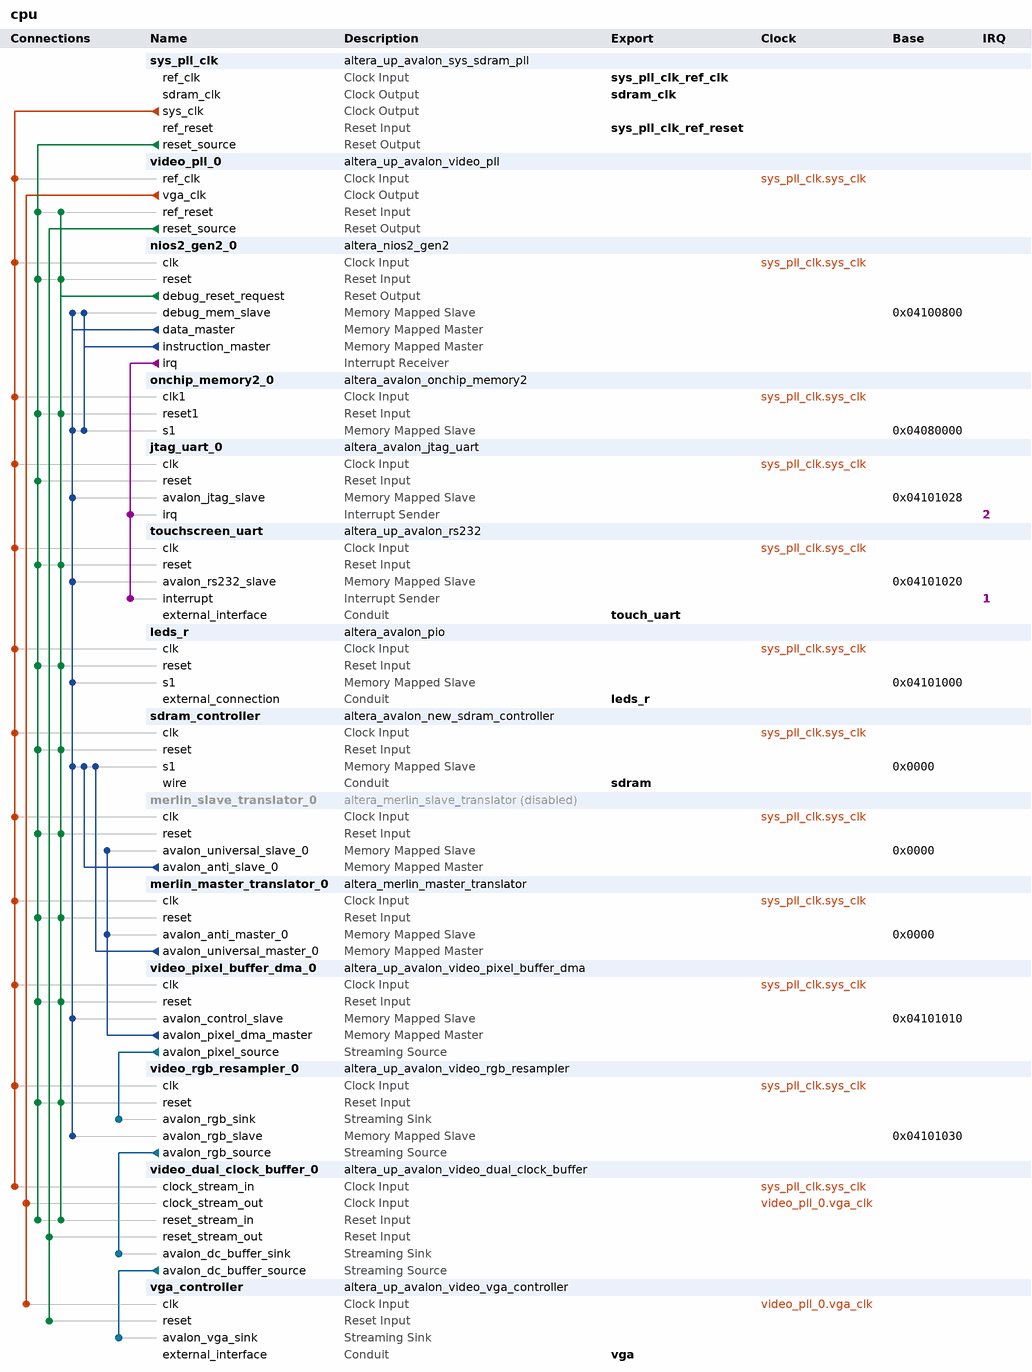
[diagram p0: system contents]
# Platform Designer (Qsys) system cpu, Cyclone V 5CSEMA5F31C6
# Parameters at their usual value, and those the tool derives, are not listed.
package require -exact qsys 18.1
create_system cpu
set_project_property DEVICE_FAMILY {Cyclone V}
set_project_property DEVICE 5CSEMA5F31C6

add_instance sys_pll_clk altera_up_avalon_sys_sdram_pll 18.0
set_instance_parameter_value sys_pll_clk CV_boards DE1-SoC
set_instance_parameter_value sys_pll_clk gui_outclk 50.0
set_instance_parameter_value sys_pll_clk gui_refclk 50.0

add_instance video_pll_0 altera_up_avalon_video_pll 18.0
set_instance_parameter_value video_pll_0 camera {8MP Digital Camera (D8M-GPIO)}
set_instance_parameter_value video_pll_0 gui_refclk 50.0
set_instance_parameter_value video_pll_0 lcd {7" LCD on VEEK-MT and MTL/MTL2 Modules}
set_instance_parameter_value video_pll_0 video_in_clk_en true

add_instance nios2_gen2_0 altera_nios2_gen2 18.1
set_instance_parameter_value nios2_gen2_0 dcache_size 2048
set_instance_parameter_value nios2_gen2_0 exceptionSlave onchip_memory2_0.s1
set_instance_parameter_value nios2_gen2_0 icache_size 4096
set_instance_parameter_value nios2_gen2_0 impl Tiny
set_instance_parameter_value nios2_gen2_0 resetSlave onchip_memory2_0.s1

add_instance onchip_memory2_0 altera_avalon_onchip_memory2 18.1
set_instance_parameter_value onchip_memory2_0 dataWidth 32
set_instance_parameter_value onchip_memory2_0 dualPort false
set_instance_parameter_value onchip_memory2_0 initMemContent true
set_instance_parameter_value onchip_memory2_0 initializationFileName onchip_mem.hex
set_instance_parameter_value onchip_memory2_0 memorySize 307200

add_instance jtag_uart_0 altera_avalon_jtag_uart 18.1
set_instance_parameter_value jtag_uart_0 simInteractiveOptions NO_INTERACTIVE_WINDOWS

add_instance touchscreen_uart altera_up_avalon_rs232 17.1
set_instance_parameter_value touchscreen_uart baud 9600
set_instance_parameter_value touchscreen_uart parity None

add_instance leds_r altera_avalon_pio 18.1
set_instance_parameter_value leds_r direction Output
set_instance_parameter_value leds_r width 8

add_instance sdram_controller altera_avalon_new_sdram_controller 18.1
set_instance_parameter_value sdram_controller TAC 5.4
set_instance_parameter_value sdram_controller TRCD 15.0
set_instance_parameter_value sdram_controller TRP 15.0
set_instance_parameter_value sdram_controller casLatency 3
set_instance_parameter_value sdram_controller columnWidth 10
set_instance_parameter_value sdram_controller dataWidth 16
set_instance_parameter_value sdram_controller generateSimulationModel false
set_instance_parameter_value sdram_controller model single_Micron_MT48LC4M32B2_7_chip
set_instance_parameter_value sdram_controller numberOfBanks 4
set_instance_parameter_value sdram_controller numberOfChipSelects 1
set_instance_parameter_value sdram_controller powerUpDelay 100.0
set_instance_parameter_value sdram_controller refreshPeriod 7.8125
set_instance_parameter_value sdram_controller rowWidth 13

add_instance merlin_slave_translator_0 altera_merlin_slave_translator 18.1
set_instance_property merlin_slave_translator_0 ENABLED false
set_instance_parameter_value merlin_slave_translator_0 AV_ADDRESSGROUP 0
set_instance_parameter_value merlin_slave_translator_0 AV_ADDRESS_SYMBOLS 0
set_instance_parameter_value merlin_slave_translator_0 AV_ADDRESS_W 25
set_instance_parameter_value merlin_slave_translator_0 AV_ALWAYSBURSTMAXBURST 0
set_instance_parameter_value merlin_slave_translator_0 AV_BITS_PER_SYMBOL 8
set_instance_parameter_value merlin_slave_translator_0 AV_BURSTBOUNDARIES 0
set_instance_parameter_value merlin_slave_translator_0 AV_BURSTCOUNT_SYMBOLS 0
set_instance_parameter_value merlin_slave_translator_0 AV_BURSTCOUNT_W 2
set_instance_parameter_value merlin_slave_translator_0 AV_BYTEENABLE_W 2
set_instance_parameter_value merlin_slave_translator_0 AV_CONSTANT_BURST_BEHAVIOR 0
set_instance_parameter_value merlin_slave_translator_0 AV_DATA_HOLD 0
set_instance_parameter_value merlin_slave_translator_0 AV_DATA_W 16
set_instance_parameter_value merlin_slave_translator_0 AV_INTERLEAVEBURSTS 0
set_instance_parameter_value merlin_slave_translator_0 AV_ISBIGENDIAN 0
set_instance_parameter_value merlin_slave_translator_0 AV_LINEWRAPBURSTS 0
set_instance_parameter_value merlin_slave_translator_0 AV_MAX_PENDING_READ_TRANSACTIONS 64
set_instance_parameter_value merlin_slave_translator_0 AV_MAX_PENDING_WRITE_TRANSACTIONS 0
set_instance_parameter_value merlin_slave_translator_0 AV_READLATENCY 0
set_instance_parameter_value merlin_slave_translator_0 AV_READ_WAIT 1
set_instance_parameter_value merlin_slave_translator_0 AV_REGISTERINCOMINGSIGNALS 0
set_instance_parameter_value merlin_slave_translator_0 AV_REGISTEROUTGOINGSIGNALS 0
set_instance_parameter_value merlin_slave_translator_0 AV_REQUIRE_UNALIGNED_ADDRESSES 0
set_instance_parameter_value merlin_slave_translator_0 AV_SETUP_WAIT 0
set_instance_parameter_value merlin_slave_translator_0 AV_SYMBOLS_PER_WORD 4
set_instance_parameter_value merlin_slave_translator_0 AV_TIMING_UNITS 1
set_instance_parameter_value merlin_slave_translator_0 AV_WRITE_WAIT 0
set_instance_parameter_value merlin_slave_translator_0 CHIPSELECT_THROUGH_READLATENCY 0
set_instance_parameter_value merlin_slave_translator_0 CLOCK_RATE 50000000
set_instance_parameter_value merlin_slave_translator_0 UAV_ADDRESSGROUP 0
set_instance_parameter_value merlin_slave_translator_0 UAV_ADDRESS_W 32
set_instance_parameter_value merlin_slave_translator_0 UAV_BURSTCOUNT_W 4
set_instance_parameter_value merlin_slave_translator_0 UAV_BYTEENABLE_W 4
set_instance_parameter_value merlin_slave_translator_0 UAV_CONSTANT_BURST_BEHAVIOR 0
set_instance_parameter_value merlin_slave_translator_0 UAV_DATA_W 32
set_instance_parameter_value merlin_slave_translator_0 USE_ADDRESS 1
set_instance_parameter_value merlin_slave_translator_0 USE_AV_CLKEN 0
set_instance_parameter_value merlin_slave_translator_0 USE_BEGINBURSTTRANSFER 0
set_instance_parameter_value merlin_slave_translator_0 USE_BEGINTRANSFER 0
set_instance_parameter_value merlin_slave_translator_0 USE_BURSTCOUNT 0
set_instance_parameter_value merlin_slave_translator_0 USE_BYTEENABLE 1
set_instance_parameter_value merlin_slave_translator_0 USE_CHIPSELECT 1
set_instance_parameter_value merlin_slave_translator_0 USE_DEBUGACCESS 0
set_instance_parameter_value merlin_slave_translator_0 USE_LOCK 0
set_instance_parameter_value merlin_slave_translator_0 USE_OUTPUTENABLE 0
set_instance_parameter_value merlin_slave_translator_0 USE_READ 1
set_instance_parameter_value merlin_slave_translator_0 USE_READDATA 1
set_instance_parameter_value merlin_slave_translator_0 USE_READDATAVALID 1
set_instance_parameter_value merlin_slave_translator_0 USE_READRESPONSE 0
set_instance_parameter_value merlin_slave_translator_0 USE_UAV_CLKEN 0
set_instance_parameter_value merlin_slave_translator_0 USE_WAITREQUEST 1
set_instance_parameter_value merlin_slave_translator_0 USE_WRITE 1
set_instance_parameter_value merlin_slave_translator_0 USE_WRITEBYTEENABLE 0
set_instance_parameter_value merlin_slave_translator_0 USE_WRITEDATA 1
set_instance_parameter_value merlin_slave_translator_0 USE_WRITERESPONSE 0

add_instance merlin_master_translator_0 altera_merlin_master_translator 18.1
set_instance_parameter_value merlin_master_translator_0 AV_ADDRESSGROUP 0
set_instance_parameter_value merlin_master_translator_0 AV_ADDRESS_SYMBOLS 0
set_instance_parameter_value merlin_master_translator_0 AV_ADDRESS_W 25
set_instance_parameter_value merlin_master_translator_0 AV_ALWAYSBURSTMAXBURST 0
set_instance_parameter_value merlin_master_translator_0 AV_BITS_PER_SYMBOL 8
set_instance_parameter_value merlin_master_translator_0 AV_BURSTBOUNDARIES 0
set_instance_parameter_value merlin_master_translator_0 AV_BURSTCOUNT_SYMBOLS 0
set_instance_parameter_value merlin_master_translator_0 AV_BURSTCOUNT_W 4
set_instance_parameter_value merlin_master_translator_0 AV_BYTEENABLE_W 4
set_instance_parameter_value merlin_master_translator_0 AV_CONSTANT_BURST_BEHAVIOR 0
set_instance_parameter_value merlin_master_translator_0 AV_DATA_HOLD 0
set_instance_parameter_value merlin_master_translator_0 AV_DATA_W 32
set_instance_parameter_value merlin_master_translator_0 AV_INTERLEAVEBURSTS 0
set_instance_parameter_value merlin_master_translator_0 AV_ISBIGENDIAN 0
set_instance_parameter_value merlin_master_translator_0 AV_LINEWRAPBURSTS 0
set_instance_parameter_value merlin_master_translator_0 AV_MAX_PENDING_READ_TRANSACTIONS 64
set_instance_parameter_value merlin_master_translator_0 AV_READLATENCY 0
set_instance_parameter_value merlin_master_translator_0 AV_READ_WAIT 0
set_instance_parameter_value merlin_master_translator_0 AV_REGISTERINCOMINGSIGNALS 0
set_instance_parameter_value merlin_master_translator_0 AV_REGISTEROUTGOINGSIGNALS 0
set_instance_parameter_value merlin_master_translator_0 AV_SETUP_WAIT 0
set_instance_parameter_value merlin_master_translator_0 AV_SYMBOLS_PER_WORD 4
set_instance_parameter_value merlin_master_translator_0 AV_WRITE_WAIT 0
set_instance_parameter_value merlin_master_translator_0 SYNC_RESET 0
set_instance_parameter_value merlin_master_translator_0 UAV_ADDRESSGROUP 0
set_instance_parameter_value merlin_master_translator_0 UAV_ADDRESS_W 32
set_instance_parameter_value merlin_master_translator_0 UAV_BURSTCOUNT_W 2
set_instance_parameter_value merlin_master_translator_0 UAV_CONSTANT_BURST_BEHAVIOR 0
set_instance_parameter_value merlin_master_translator_0 USE_ADDRESS 1
set_instance_parameter_value merlin_master_translator_0 USE_BEGINBURSTTRANSFER 0
set_instance_parameter_value merlin_master_translator_0 USE_BEGINTRANSFER 0
set_instance_parameter_value merlin_master_translator_0 USE_BURSTCOUNT 0
set_instance_parameter_value merlin_master_translator_0 USE_BYTEENABLE 0
set_instance_parameter_value merlin_master_translator_0 USE_CHIPSELECT 0
set_instance_parameter_value merlin_master_translator_0 USE_CLKEN 0
set_instance_parameter_value merlin_master_translator_0 USE_DEBUGACCESS 0
set_instance_parameter_value merlin_master_translator_0 USE_LOCK 1
set_instance_parameter_value merlin_master_translator_0 USE_READ 1
set_instance_parameter_value merlin_master_translator_0 USE_READDATA 1
set_instance_parameter_value merlin_master_translator_0 USE_READDATAVALID 1
set_instance_parameter_value merlin_master_translator_0 USE_READRESPONSE 0
set_instance_parameter_value merlin_master_translator_0 USE_WAITREQUEST 1
set_instance_parameter_value merlin_master_translator_0 USE_WRITE 0
set_instance_parameter_value merlin_master_translator_0 USE_WRITEDATA 0
set_instance_parameter_value merlin_master_translator_0 USE_WRITERESPONSE 0

add_instance video_pixel_buffer_dma_0 altera_up_avalon_video_pixel_buffer_dma 18.0
set_instance_parameter_value video_pixel_buffer_dma_0 addr_mode Consecutive
set_instance_parameter_value video_pixel_buffer_dma_0 back_start_address 33554432
set_instance_parameter_value video_pixel_buffer_dma_0 color_space {24-bit RGB}
set_instance_parameter_value video_pixel_buffer_dma_0 image_height 480
set_instance_parameter_value video_pixel_buffer_dma_0 image_width 640
set_instance_parameter_value video_pixel_buffer_dma_0 start_address 33554432

add_instance video_rgb_resampler_0 altera_up_avalon_video_rgb_resampler 18.0
set_instance_parameter_value video_rgb_resampler_0 alpha 1023
set_instance_parameter_value video_rgb_resampler_0 input_type {24-bit RGB}
set_instance_parameter_value video_rgb_resampler_0 output_type {30-bit RGB}

add_instance video_dual_clock_buffer_0 altera_up_avalon_video_dual_clock_buffer 18.0
set_instance_parameter_value video_dual_clock_buffer_0 color_bits 10

add_instance vga_controller altera_up_avalon_video_vga_controller 18.0
set_instance_parameter_value vga_controller board DE1-SoC
set_instance_parameter_value vga_controller resolution {VGA 640x480}

# connections
add_connection sys_pll_clk.sys_clk jtag_uart_0.clk clock
add_connection sys_pll_clk.sys_clk leds_r.clk clock
add_connection sys_pll_clk.sys_clk merlin_master_translator_0.clk clock
add_connection sys_pll_clk.sys_clk merlin_slave_translator_0.clk clock
add_connection sys_pll_clk.sys_clk nios2_gen2_0.clk clock
add_connection sys_pll_clk.sys_clk onchip_memory2_0.clk1 clock
add_connection sys_pll_clk.sys_clk sdram_controller.clk clock
add_connection sys_pll_clk.sys_clk touchscreen_uart.clk clock
add_connection sys_pll_clk.sys_clk video_dual_clock_buffer_0.clock_stream_in clock
add_connection sys_pll_clk.sys_clk video_pixel_buffer_dma_0.clk clock
add_connection sys_pll_clk.sys_clk video_pll_0.ref_clk clock
add_connection sys_pll_clk.sys_clk video_rgb_resampler_0.clk clock
add_connection video_pll_0.vga_clk vga_controller.clk clock
add_connection video_pll_0.vga_clk video_dual_clock_buffer_0.clock_stream_out clock
add_connection nios2_gen2_0.debug_reset_request leds_r.reset reset
add_connection nios2_gen2_0.debug_reset_request merlin_master_translator_0.reset reset
add_connection nios2_gen2_0.debug_reset_request merlin_slave_translator_0.reset reset
add_connection nios2_gen2_0.debug_reset_request nios2_gen2_0.reset reset
add_connection nios2_gen2_0.debug_reset_request onchip_memory2_0.reset1 reset
add_connection nios2_gen2_0.debug_reset_request sdram_controller.reset reset
add_connection nios2_gen2_0.debug_reset_request touchscreen_uart.reset reset
add_connection nios2_gen2_0.debug_reset_request video_dual_clock_buffer_0.reset_stream_in reset
add_connection nios2_gen2_0.debug_reset_request video_pixel_buffer_dma_0.reset reset
add_connection nios2_gen2_0.debug_reset_request video_pll_0.ref_reset reset
add_connection nios2_gen2_0.debug_reset_request video_rgb_resampler_0.reset reset
add_connection sys_pll_clk.reset_source jtag_uart_0.reset reset
add_connection sys_pll_clk.reset_source leds_r.reset reset
add_connection sys_pll_clk.reset_source merlin_master_translator_0.reset reset
add_connection sys_pll_clk.reset_source merlin_slave_translator_0.reset reset
add_connection sys_pll_clk.reset_source nios2_gen2_0.reset reset
add_connection sys_pll_clk.reset_source onchip_memory2_0.reset1 reset
add_connection sys_pll_clk.reset_source sdram_controller.reset reset
add_connection sys_pll_clk.reset_source touchscreen_uart.reset reset
add_connection sys_pll_clk.reset_source video_dual_clock_buffer_0.reset_stream_in reset
add_connection sys_pll_clk.reset_source video_pixel_buffer_dma_0.reset reset
add_connection sys_pll_clk.reset_source video_pll_0.ref_reset reset
add_connection sys_pll_clk.reset_source video_rgb_resampler_0.reset reset
add_connection video_pll_0.reset_source vga_controller.reset reset
add_connection video_pll_0.reset_source video_dual_clock_buffer_0.reset_stream_out reset
add_connection merlin_master_translator_0.avalon_universal_master_0 sdram_controller.s1 avalon
set_connection_parameter_value merlin_master_translator_0.avalon_universal_master_0/sdram_controller.s1 baseAddress 0x0000
add_connection merlin_slave_translator_0.avalon_anti_slave_0 sdram_controller.s1 avalon
set_connection_parameter_value merlin_slave_translator_0.avalon_anti_slave_0/sdram_controller.s1 baseAddress 0x0000
add_connection nios2_gen2_0.data_master jtag_uart_0.avalon_jtag_slave avalon
set_connection_parameter_value nios2_gen2_0.data_master/jtag_uart_0.avalon_jtag_slave baseAddress 0x04101028
add_connection nios2_gen2_0.data_master leds_r.s1 avalon
set_connection_parameter_value nios2_gen2_0.data_master/leds_r.s1 baseAddress 0x04101000
add_connection nios2_gen2_0.data_master nios2_gen2_0.debug_mem_slave avalon
set_connection_parameter_value nios2_gen2_0.data_master/nios2_gen2_0.debug_mem_slave baseAddress 0x04100800
add_connection nios2_gen2_0.data_master onchip_memory2_0.s1 avalon
set_connection_parameter_value nios2_gen2_0.data_master/onchip_memory2_0.s1 baseAddress 0x04080000
add_connection nios2_gen2_0.data_master sdram_controller.s1 avalon
set_connection_parameter_value nios2_gen2_0.data_master/sdram_controller.s1 baseAddress 0x0000
add_connection nios2_gen2_0.data_master touchscreen_uart.avalon_rs232_slave avalon
set_connection_parameter_value nios2_gen2_0.data_master/touchscreen_uart.avalon_rs232_slave baseAddress 0x04101020
add_connection nios2_gen2_0.data_master video_pixel_buffer_dma_0.avalon_control_slave avalon
set_connection_parameter_value nios2_gen2_0.data_master/video_pixel_buffer_dma_0.avalon_control_slave baseAddress 0x04101010
add_connection nios2_gen2_0.data_master video_rgb_resampler_0.avalon_rgb_slave avalon
set_connection_parameter_value nios2_gen2_0.data_master/video_rgb_resampler_0.avalon_rgb_slave baseAddress 0x04101030
add_connection nios2_gen2_0.instruction_master nios2_gen2_0.debug_mem_slave avalon
set_connection_parameter_value nios2_gen2_0.instruction_master/nios2_gen2_0.debug_mem_slave baseAddress 0x04100800
add_connection nios2_gen2_0.instruction_master onchip_memory2_0.s1 avalon
set_connection_parameter_value nios2_gen2_0.instruction_master/onchip_memory2_0.s1 baseAddress 0x04080000
add_connection video_pixel_buffer_dma_0.avalon_pixel_dma_master merlin_master_translator_0.avalon_anti_master_0 avalon
set_connection_parameter_value video_pixel_buffer_dma_0.avalon_pixel_dma_master/merlin_master_translator_0.avalon_anti_master_0 baseAddress 0x0000
add_connection video_pixel_buffer_dma_0.avalon_pixel_dma_master merlin_slave_translator_0.avalon_universal_slave_0 avalon
set_connection_parameter_value video_pixel_buffer_dma_0.avalon_pixel_dma_master/merlin_slave_translator_0.avalon_universal_slave_0 baseAddress 0x0000
add_connection video_dual_clock_buffer_0.avalon_dc_buffer_source vga_controller.avalon_vga_sink avalon_streaming
add_connection video_pixel_buffer_dma_0.avalon_pixel_source video_rgb_resampler_0.avalon_rgb_sink avalon_streaming
add_connection video_rgb_resampler_0.avalon_rgb_source video_dual_clock_buffer_0.avalon_dc_buffer_sink avalon_streaming
add_connection nios2_gen2_0.irq jtag_uart_0.irq interrupt
set_connection_parameter_value nios2_gen2_0.irq/jtag_uart_0.irq irqNumber 2
add_connection nios2_gen2_0.irq touchscreen_uart.interrupt interrupt
set_connection_parameter_value nios2_gen2_0.irq/touchscreen_uart.interrupt irqNumber 1

# exported interfaces
add_interface leds_r conduit end
set_interface_property leds_r EXPORT_OF leds_r.external_connection
add_interface sdram conduit end
set_interface_property sdram EXPORT_OF sdram_controller.wire
add_interface sdram_clk clock source
set_interface_property sdram_clk EXPORT_OF sys_pll_clk.sdram_clk
add_interface sys_pll_clk_ref_clk clock sink
set_interface_property sys_pll_clk_ref_clk EXPORT_OF sys_pll_clk.ref_clk
add_interface sys_pll_clk_ref_reset reset sink
set_interface_property sys_pll_clk_ref_reset EXPORT_OF sys_pll_clk.ref_reset
add_interface touch_uart conduit end
set_interface_property touch_uart EXPORT_OF touchscreen_uart.external_interface
add_interface vga conduit end
set_interface_property vga EXPORT_OF vga_controller.external_interface

set_interconnect_requirement {$system} qsys_mm.clockCrossingAdapter HANDSHAKE
set_interconnect_requirement {$system} qsys_mm.enableEccProtection FALSE
set_interconnect_requirement {$system} qsys_mm.insertDefaultSlave FALSE
set_interconnect_requirement {$system} qsys_mm.maxAdditionalLatency 1

save_system cpu.qsys
